# Altium schematic sheet POWER SUPPLY.SchDoc: POWER SUPPLY
size A3; Engineer: M.GUENI; Revision: R0; SheetNumber: 02; SheetTotal: 10
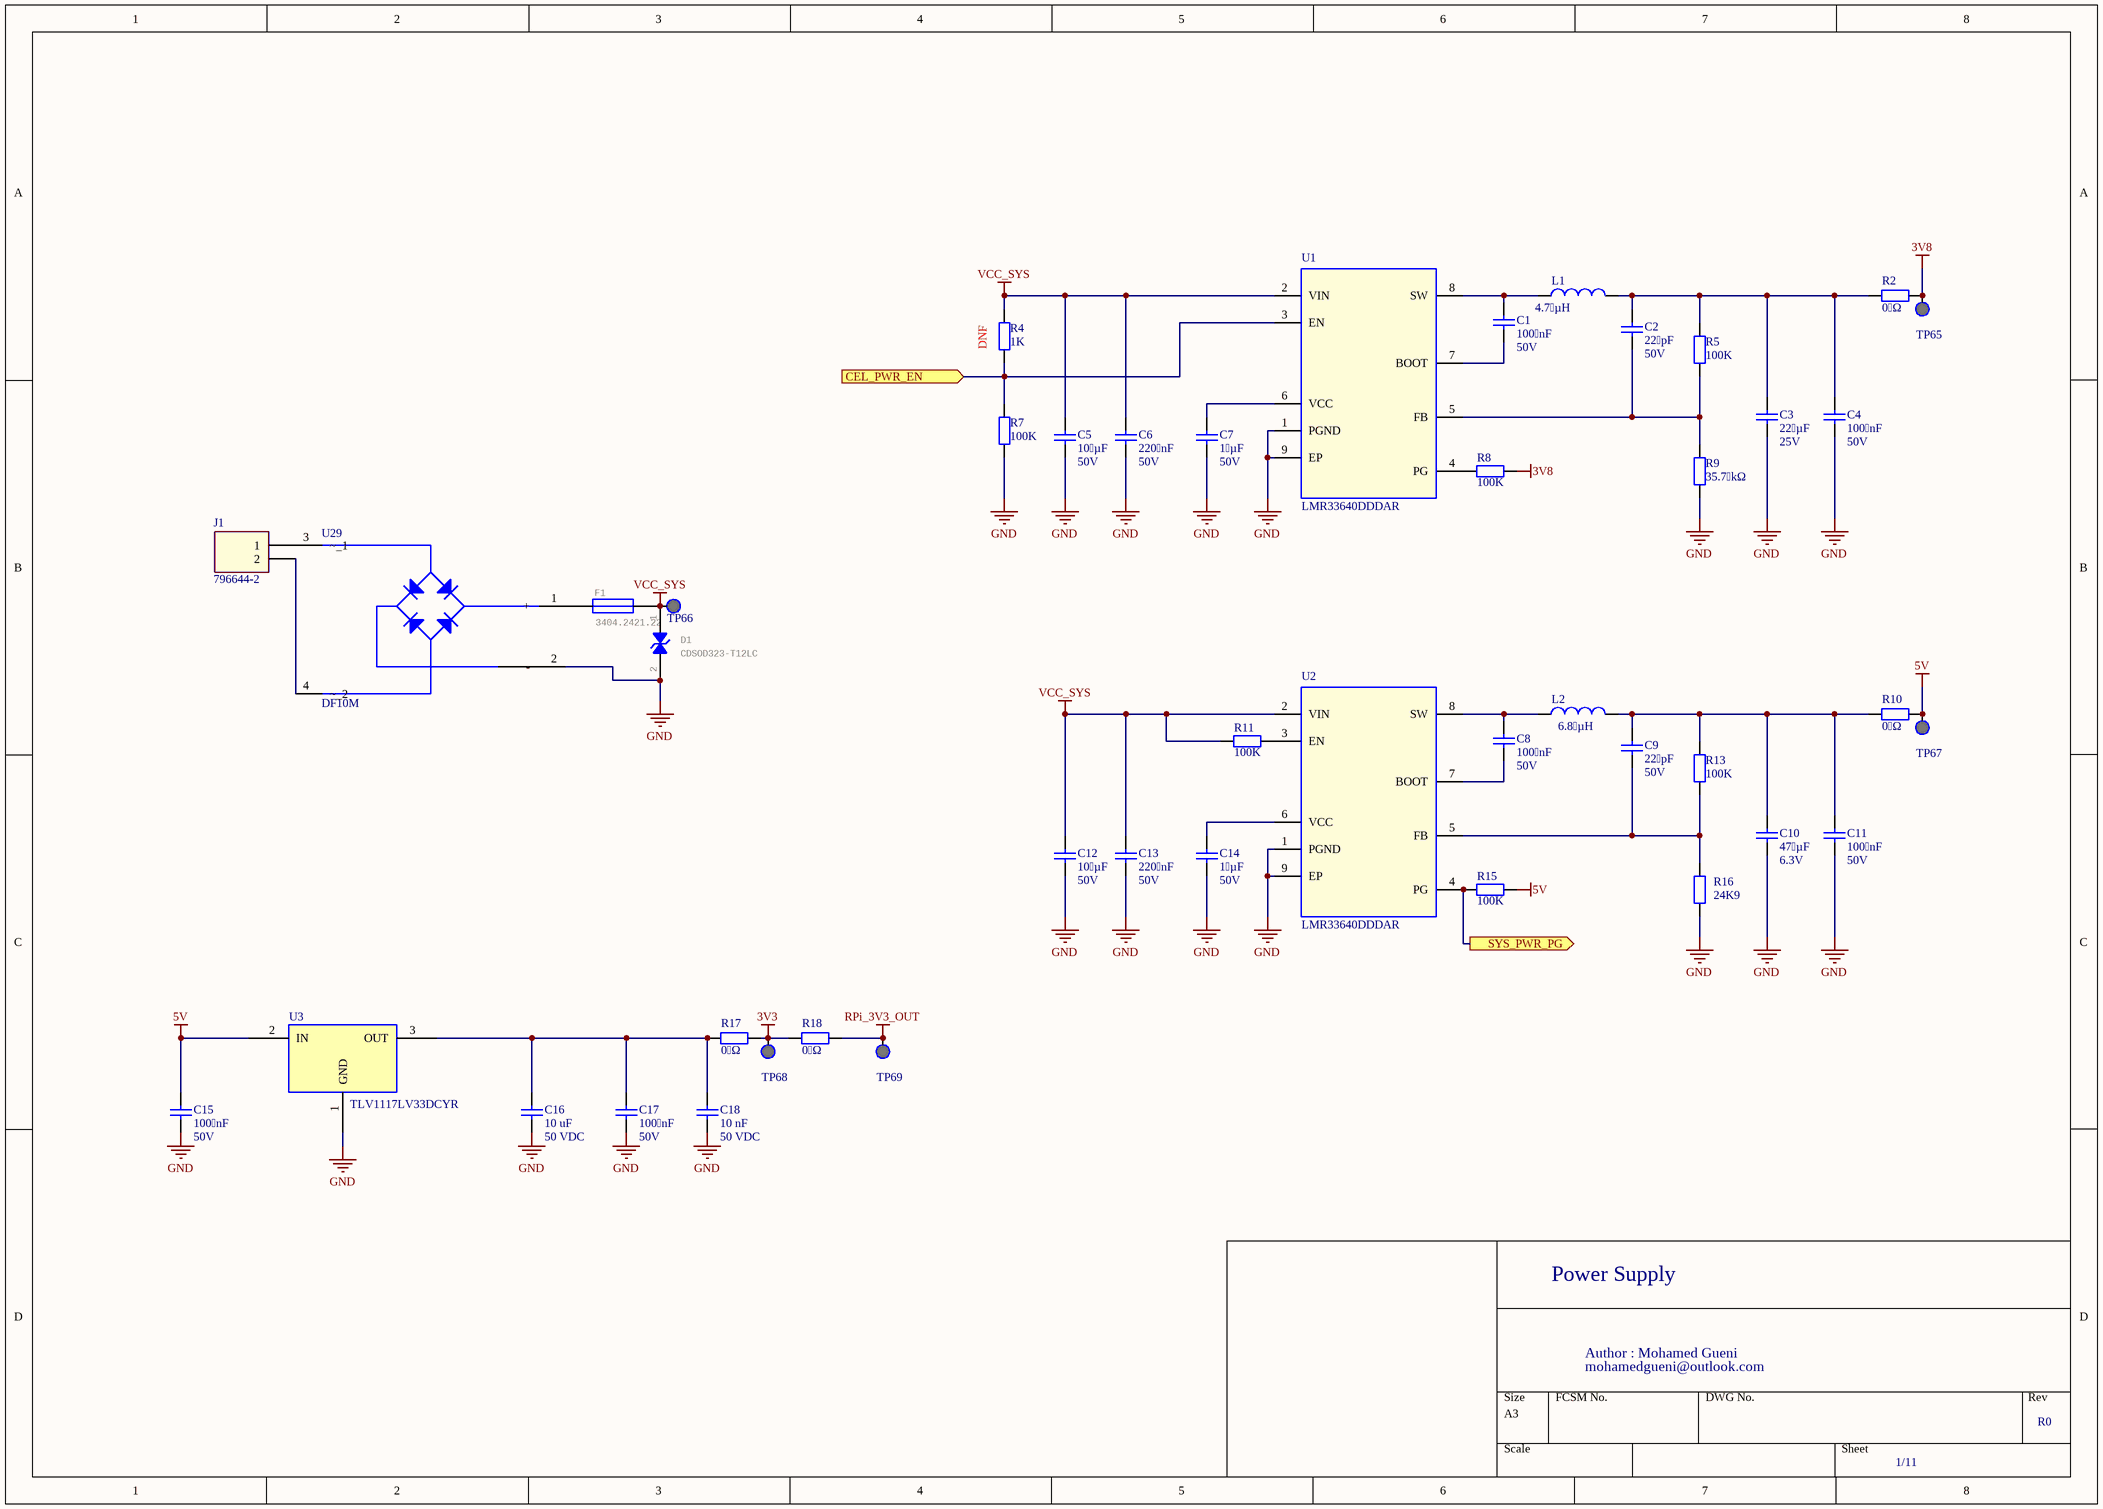
[diagram p0: POWER SUPPLY.SchDoc]

## Parts
C1  Value 1: 100 nF  Value 2: 50V  [CAPC1608N]  (hidden comment: Capacitor)
C2  Value 1: 22 pF  Value 2: 50V  [CAPC1608N]  (hidden comment: Capacitor)
C3  Value 1: 22 µF  Value 2: 25V  [CAPC1608N]  (hidden comment: Capacitor)
C4  Value 1: 100 nF  Value 2: 50V  [CAPC1608N]  (hidden comment: Capacitor)
C5  Value 1: 10 µF  Value 2: 50V  [CAPC1608N]  (hidden comment: Capacitor)
C6  Value 1: 220 nF  Value 2: 50V  [CAPC1608N]  (hidden comment: Capacitor)
C7  Value 1: 1 µF  Value 2: 50V  [CAPC1608N]  (hidden comment: Capacitor)
C8  Value 1: 100 nF  Value 2: 50V  [CAPC1608N]  (hidden comment: Capacitor)
C9  Value 1: 22 pF  Value 2: 50V  [CAPC1608N]  (hidden comment: Capacitor)
C10  Value 1: 47 µF  Value 2: 6.3V  [CAPC1210]  (hidden comment: T491D476K006AT)
C11  Value 1: 100 nF  Value 2: 50V  [CAPC1608N]  (hidden comment: Capacitor)
C12  Value 1: 10 µF  Value 2: 50V  [CAPC1608N]  (hidden comment: Capacitor)
C13  Value 1: 220 nF  Value 2: 50V  [CAPC1608N]  (hidden comment: Capacitor)
C14  Value 1: 1 µF  Value 2: 50V  [CAPC1608N]  (hidden comment: Capacitor)
C15  Value 1: 100 nF  Value 2: 50V  [CAPC1608N]  (hidden comment: Capacitor)
C16  Value 1: 10 uF  Value 2: 50 VDC  [CAPC1608N]  (hidden comment: GRM188R61E106MA73D)
C17  Value 1: 100 nF  Value 2: 50V  [CAPC1608N]  (hidden comment: Capacitor)
C18  Value 1: 10 nF  Value 2: 50 VDC  [CAPC1608N]  (hidden comment: C0603C103J5RACTU)
D1  CDSOD323-T12LC  [CDSOD323T12LC]
F1  3404.2421.22  [3404242122]
J1  796644-2  [7966442]
L1  Value 1: 4.7 µH  [1.5uH-XAL4020]  (hidden comment: XGL4030-472MEC)
L2  Value 1: 6.8 µH  [1.5uH-XAL4020]  (hidden comment: NRS4018T6R8MDGJ)
R2  Value 1: 0 Ω  [RESC1608N]  (hidden comment: Resistor)
R4  Value 1: 1K  [RESC1608N]  (hidden comment: Resistor)
R5  Value 1: 100K  [RESC1608N]  (hidden comment: Resistor)
R7  Value 1: 100K  [RESC1608N]  (hidden comment: Resistor)
R8  Value 1: 100K  [RESC1608N]  (hidden comment: Resistor)
R9  Value 1: 35.7 kΩ  [RESC1608N]  (hidden comment: Resistor)
R10  Value 1: 0 Ω  [RESC1608N]  (hidden comment: Resistor)
R11  Value 1: 100K  [RESC1608N]  (hidden comment: Resistor)
R13  Value 1: 100K  [RESC1608N]  (hidden comment: Resistor)
R15  Value 1: 100K  [RESC1608N]  (hidden comment: Resistor)
R16  Value 1: 24K9  [RESC1608N]  (hidden comment: RN731JTTD2492F25)
R17  Value 1: 0 Ω  [RESC1608N]  (hidden comment: Resistor)
R18  Value 1: 0 Ω  [RESC1608N]  (hidden comment: Resistor)
TP65  Test Point  [TP]  (value not drawn)  (no BOM)
TP66  Test Point  [TP]  (value not drawn)  (no BOM)
TP67  Test Point  [TP]  (value not drawn)  (no BOM)
TP68  Test Point  [TP]  (value not drawn)  (no BOM)
TP69  Test Point  [TP]  (value not drawn)  (no BOM)
U1  LMR33640DDDAR  [SOIC127P600X170-9N]
U2  LMR33640DDDAR  [SOIC127P600X170-9N]
U3  TLV1117LV33DCYR  [SOT-223-4]
U29  DF10M  [621-DF10M]

## Ports
CEL_PWR_EN (in), SYS_PWR_PG (out)

## Nets
3V3: R17.2 R18.1 TP68.1
3V8: R2.2 R8.1 TP65.1
5V: C15.2 R10.2 R15.1 TP67.1 U3.2(IN)
GND: C3.1 C4.1 C5.1 C6.1 C7.1 C10.1 C11.1 C12.1 C13.1 C14.1 C15.1 C16.1 C17.1 C18.1 D1.2 R7.1 R9.1 R16.1 U1.1(PGND) U1.9(EP) U2.1(PGND) U2.9(EP) U3.1(GND) U29.2(-)
RPi_3V3_OUT: R18.2 TP69.1
VCC_SYS: C5.2 C6.2 C12.2 C13.2 D1.1 F1.2 R4.2 R11.2 TP66.1 U1.2(VIN) U2.2(VIN)
CEL_PWR_EN: R4.1 R7.2 U1.3(EN) ; port CEL_PWR_EN
SYS_PWR_PG: R15.2 U2.4(PG) ; port SYS_PWR_PG
NetC1_1: C1.1 U1.7(BOOT)
NetC1_2: C1.2 L1.1 U1.8(SW)
NetC2_1: C2.1 R5.2 R9.2 U1.5(FB)
NetC2_2: C2.2 C3.2 C4.2 L1.2 R2.1 R5.1
NetC7_2: C7.2 U1.6(VCC)
NetC8_1: C8.1 U2.7(BOOT)
NetC8_2: C8.2 L2.1 U2.8(SW)
NetC9_1: C9.1 R13.2 R16.2 U2.5(FB)
NetC9_2: C9.2 C10.2 C11.2 L2.2 R10.1 R13.1
NetC14_2: C14.2 U2.6(VCC)
NetC16_2: C16.2 C17.2 C18.2 R17.1 U3.3(OUT)
NetF1_1: F1.1 U29.1(+)
NetJ1_1: J1.1 U29.3(~_1)
NetJ1_2: J1.2 U29.4(~_2)
NetR8_2: R8.2 U1.4(PG)
NetR11_1: R11.1 U2.3(EN)

## Notes on the sheet
- (near R4) DNF
- Power Supply
- Author : Mohamed Gueni
- mohamedgueni@outlook.com
- R0
- 1/11
- Title:
- Micro Device Tunisie
- Size:
- Date:
- File:
- A3
- Engineer :
- Revision:
- Sheet
- of
- Cyber Parc  Hammam Sousse
- Avenue Charles De Gaulle
- 4011, Hammam-Sousse, Tunisie
- contact@mdtunisie.com

## Library data of the parts
C1 C4 C8 C11 C15 C17 = CAP-000000017: MAN: Murata; MANREF: GRM188R71H104KA93D; DES: Ceramic Capacitor, 100 nF, 50V, X7R, 0603; FTP: 603; SUPREF: 81-GRM188R71H104KA93D; Part Number: CAP-000000017
C2 C9 = CAP-000000027: MAN: Murata; MANREF: GRM1885C1H220JA01D; DES: Ceramic Capacitor, 22 pF, 50V, C0G, 0603; FTP: 603; SUPREF: 81-GRM1885C1H220JA01D; Part Number: CAP-000000027
C3 = CAP-000000024: MAN: Murata; MANREF: GRM188R61E226ME15D; DES: Ceramic Capacitor, 22 µF, 25V, X5R, 0603; FTP: 603; SUPREF: 81-GRM188R61E226ME15D; Part Number: CAP-000000024
C5 C12 = CAP-000000025: MAN: Murata; MANREF: GRM188R61H106KAALD; DES: Ceramic Capacitor, 10 µF, 50V, X5R, 0603; FTP: 603; SUPREF: 81-GRM188R61H106KAALD; Part Number: CAP-000000025
C6 C13 = CAP-000000026: MAN: Murata; MANREF: GRM188R71H224KA93D; DES: Ceramic Capacitor, 220 nF, 50V, X7R, 0603; FTP: 603; SUPREF: 81-GRM188R71H224KA93D; Part Number: CAP-000000026
C7 C14 = CAP-000000018: MAN: Murata; MANREF: GRM188R61H105KAALD; DES: Ceramic Capacitor, 1 µF, 50V, X5R, 0603; FTP: 603; SUPREF: 81-GRM188R61H105KAALD; Part Number: CAP-000000018
C10 = CAP-000000029: MAN: KEMET; DES: Tantalum Capacitor, 47 µF, 6.3V, 1210; FTP: 1210; SUPREF: 581-T491D476K006AT; Part Number: CAP-000000029; MANREF: T491D476K006AT
C16 = CAP-000000002: MAN: Murata Electronics; DES: Multilayer Ceramic Capacitors MLCC - SMD/SMT RECOMMENDED ALT 810-C3225X7R1H106250; TOL: 20 %; FTP: 0603; SUP: Mouser; SUPREF: 81-GRM188R61E106MA3D; NOTE: _; Part Number: CAP-000000002; MANREF: GRM188R61E106MA73D
C18 = CAP-000000006: MAN: KEMET; DES: Multilayer Ceramic Capacitors MLCC - SMD/SMT 50V 0.01uF 0603 X7R 5%; TOL: 5 %; FTP: 0603; SUP: Mouser; SUPREF: 80-C0603C103J5R; NOTE: _; Part Number: CAP-000000006; MANREF: C0603C103J5RACTU
D1 = TVS-000000003: MAN: Bourns; DES: ESD Protection Diodes / TVS Diodes Bidirectional Ultra Low Cap; Value 1: 12 V; Value 2: 11 A; TOL: _; FTP: SOD-323-2; SUP: Mouser; SUPREF: 652-CDSOD323-T12LC; Part Number: TVS-000000003; MANREF: CDSOD323-T12LC; NOTE: _
F1 = FU-000000001: MAN: Schurter; DES: Surface Mount Fuses UMZ 250 FUSE WITH HOLDER 3.15A T; Value 1: 3.15 A; Value 2: 250 VAC; TOL: 200 A at 250 VAC, 100 A at 125 VDC; FTP: 11.1 mm x 4.2 mm; SUP: Mouser; SUPREF: 693-3404.2421.22; NOTE: _; Part Number: FU-000000001; MANREF: 3404.2421.22
J1 = CON-000000016: MAN: TE Connectivity; DES: SIMM Connectors PUSH-PUSH NANO SIM CONNECTOR; FTP: THT; SUP: Mouser; SUPREF: 571-796644-2; Part Number: CON-000000016; MANREF: 796644-2
L1 = IND-000000003: MAN: Coilcraft; DES: Fixed Inductors 1.5uH Shld 20% 7.5A 23.6mOhms AECQ2; FTP: 1616; SUP: Mouser; SUPREF: 994-XGL4030-472MEC; Part Number: IND-000000003; MANREF: XGL4030-472MEC
L2 = IND-000000005: MAN: TAIYO YUDEN; DES: Fixed Inductors 1.5uH Shld 20% 7.5A 23.6mOhms AECQ2; FTP: 1616; SUP: Mouser; SUPREF: 963-NRS4018T6R8MDGJ; Part Number: IND-000000005; MANREF: NRS4018T6R8MDGJ
R2 R10 R17 R18 = RES-0000000017: MAN: Stackpole Electronics; MANREF: RMCF0603ZT0R00; DES: Thick Film Resistor, 0 Ω (Jumper), 100 mW, 0603; TOL: 1%; FTP: 0603; SUP: Mouser; SUPREF: 71-CRCW06030000Z0EA; NOTE: _; Part Number: RES-0000000017
R4 = RES-000000001: MAN: KOA Speer; MANREF: RN731JTTD1001F25; DES: Thin Film Resistors - SMD 1kOhm,0603,1%,25ppm, 63mW,50V; Value 2: 0.63W; TOL: 1%; FTP: 0603; SUP: Mouser; SUPREF: 660-RN731JTTD1001F25; NOTE: _; Part Number: RES-000000001
R5 R7 R8 R11 R13 R15 = RES-000000002: MAN: KOA Speer; MANREF: RN731JTTD1003F100; DES: Thin Film Resistors - SMD 0603 100 Kohms 1% 10PPM; Value 2: 0.63W; TOL: 1%; FTP: 0603; SUP: Mouser; SUPREF: 660-RN731JTD1003F100; NOTE: _; Part Number: RES-000000002
R9 = RES-0000000016: MAN: Panasonic; MANREF: ERJ-3EKF3572V; DES: Thick Film Resistor, 35.7 kΩ, 1%, 200 mW, 0603; TOL: 1%; FTP: 0603; SUP: Mouser; SUPREF: 667-ERJ-3EKF3572V; NOTE: _; Part Number: RES-0000000016
R16 = RES-000000003: MAN: KOA Speer; DES: Thin Film Resistors - SMD 24.9kOhm,0603,1%,25p pm,63mW,50V; Value 2: 0.63W; TOL: 1%; FTP: 0603; SUP: Mouser; SUPREF: 660-RN731JTTD2492F25; NOTE: _; Part Number: RES-000000003; MANREF: RN731JTTD2492F25
TP65-TP69 = MIS-000000002: MAN: _; Part Number: MIS-000000002; MANREF: _; DES: _; Value 1: _; Value 2: _; TOL: _; FTP: _; SUP: _; SUPREF: _; NOTE: _
U1 U2 = VRG-000000003: MAN: Texas Instruments; DES: Bridge Rectifiers 1000V 1A; Value 1: 1 V to 24 V; Value 2: 4 A; TOL: _; FTP: 621-DF10M; SUP: Mouser; SUPREF: 595-LMR33640DDDAR; Part Number: VRG-000000003; MANREF: LMR33640DDDAR; NOTE: -
U3 = VRG-000000001: MAN: Texas Instrument; DES: TEXAS INSTRUMENTS  TLV1117LV33DCYR  LDO FIXE 3.3V 1A SOT-223-4; Value 1: 3.3V; Value 2: 1A; TOL: _; FTP: SOT-223; SUP: Farnell; SUPREF: 2323647; Part Number: VRG-000000001; MANREF: TLV1117LV33DCYR; NOTE: -
U29 = VRG-000000002: MAN: Diodes Incorporated; DES: Bridge Rectifiers 1000V 1A; Value 1: 1 kV; Value 2: 1A; TOL: _; SUP: Mouser; Part Number: VRG-000000002; MANREF: DF10M; FTP: 621-DF10M; SUPREF: 621-DF10M; NOTE: -